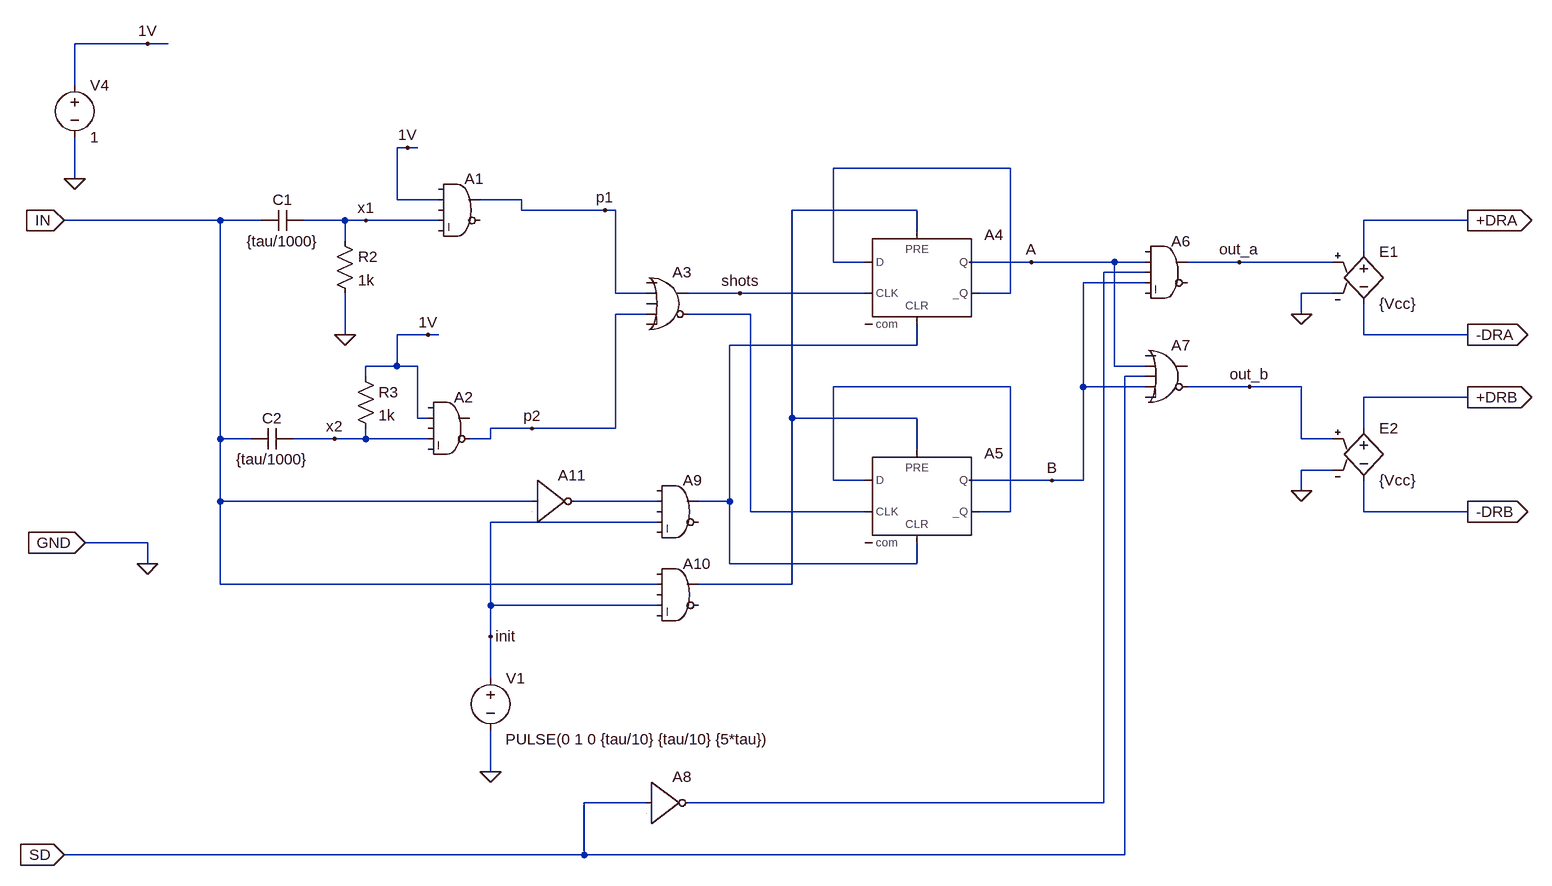
[diagram p0: schematic DriverHB_dead_time_component.asc]
DriverHB_dead_time_component.asc, the LTspice schematic file:
Version 4
SHEET 1 1872 1944
WIRE -416 464 -528 464
WIRE -384 464 -416 464
WIRE -528 528 -528 464
WIRE -16 624 -32 624
WIRE 0 624 -16 624
WIRE 912 656 640 656
WIRE -528 672 -528 608
WIRE -32 704 -32 624
WIRE 32 704 -32 704
WIRE 160 704 96 704
WIRE 160 720 160 704
WIRE 288 720 160 720
WIRE 304 720 288 720
WIRE 768 720 576 720
WIRE -304 736 -544 736
WIRE -240 736 -304 736
WIRE -112 736 -176 736
WIRE -80 736 -112 736
WIRE 32 736 -80 736
WIRE 1616 736 1456 736
WIRE 768 752 768 720
WIRE -112 768 -112 736
WIRE 1456 784 1456 736
WIRE 640 800 640 656
WIRE 688 800 640 800
WIRE 944 800 848 800
WIRE 1072 800 944 800
WIRE 1120 800 1072 800
WIRE 1264 800 1184 800
WIRE 1408 800 1264 800
WIRE 1120 816 1056 816
WIRE 1120 832 1024 832
WIRE 304 848 304 720
WIRE 352 848 304 848
WIRE 496 848 416 848
WIRE 688 848 496 848
WIRE 912 848 912 656
WIRE 912 848 864 848
WIRE 1408 848 1360 848
WIRE 352 880 304 880
WIRE 512 880 416 880
WIRE 1360 880 1360 848
WIRE -112 912 -112 848
WIRE 16 912 -32 912
WIRE 32 912 16 912
WIRE 1456 912 1456 864
WIRE 1616 912 1456 912
WIRE 768 928 768 896
WIRE 768 928 480 928
WIRE -32 960 -32 912
WIRE -32 960 -80 960
WIRE 0 960 -32 960
WIRE 1072 960 1072 800
WIRE 1120 960 1072 960
WIRE -80 976 -80 960
WIRE 1120 976 1088 976
WIRE 912 992 640 992
WIRE 1024 992 1024 832
WIRE 1120 992 1024 992
WIRE 1280 992 1184 992
WIRE 1360 992 1280 992
WIRE 1616 1008 1456 1008
WIRE 0 1040 0 960
WIRE 16 1040 0 1040
WIRE 576 1040 576 720
WIRE 768 1040 576 1040
WIRE 176 1056 112 1056
WIRE 304 1056 304 880
WIRE 304 1056 176 1056
WIRE 1456 1056 1456 1008
WIRE -304 1072 -304 736
WIRE -256 1072 -304 1072
WIRE -128 1072 -192 1072
WIRE -80 1072 -80 1056
WIRE -80 1072 -128 1072
WIRE 16 1072 -80 1072
WIRE 112 1072 112 1056
WIRE 112 1072 80 1072
WIRE 1360 1072 1360 992
WIRE 1408 1072 1360 1072
WIRE 768 1088 768 1040
WIRE 1408 1120 1360 1120
WIRE 640 1136 640 992
WIRE 688 1136 640 1136
WIRE 976 1136 848 1136
WIRE 1024 1136 1024 992
WIRE 1024 1136 976 1136
WIRE 1360 1152 1360 1120
WIRE -304 1168 -304 1072
WIRE 176 1168 -304 1168
WIRE 368 1168 240 1168
WIRE 480 1168 480 928
WIRE 480 1168 432 1168
WIRE 512 1184 512 880
WIRE 688 1184 512 1184
WIRE 912 1184 912 992
WIRE 912 1184 864 1184
WIRE 1456 1184 1456 1136
WIRE 1616 1184 1456 1184
WIRE 368 1200 112 1200
WIRE -416 1232 -512 1232
WIRE -416 1264 -416 1232
WIRE 480 1264 480 1168
WIRE 768 1264 768 1232
WIRE 768 1264 480 1264
WIRE -304 1296 -304 1168
WIRE 368 1296 -304 1296
WIRE 576 1296 576 1040
WIRE 576 1296 432 1296
WIRE 112 1328 112 1200
WIRE 368 1328 112 1328
WIRE 112 1376 112 1328
WIRE 112 1440 112 1376
WIRE 112 1584 112 1520
WIRE 352 1632 256 1632
WIRE 1056 1632 1056 816
WIRE 1056 1632 416 1632
WIRE 256 1712 256 1632
WIRE 256 1712 -544 1712
WIRE 1088 1712 1088 976
WIRE 1088 1712 256 1712
FLAG -16 624 1V
FLAG -112 912 0
FLAG 288 720 p1
FLAG 176 1056 p2
FLAG 16 912 1V
FLAG -80 736 x1
FLAG -128 1072 x2
FLAG -528 672 0
FLAG -416 464 1V
FLAG 496 848 shots
FLAG 944 800 A
FLAG 976 1136 B
FLAG 1264 800 out_a
FLAG 1280 992 out_b
FLAG 1360 880 0
FLAG 1616 736 +DRA
IOPIN 1616 736 Out
FLAG 1616 912 -DRA
IOPIN 1616 912 Out
FLAG 1360 1152 0
FLAG 1616 1008 +DRB
IOPIN 1616 1008 Out
FLAG 1616 1184 -DRB
IOPIN 1616 1184 Out
FLAG -544 736 IN
IOPIN -544 736 In
FLAG -544 1712 SD
IOPIN -544 1712 In
FLAG 112 1584 0
FLAG -416 1264 0
FLAG -512 1232 GND
IOPIN -512 1232 In
FLAG 112 1376 init
SYMBOL cap -176 720 R90
WINDOW 0 0 32 VBottom 2
WINDOW 3 32 32 VTop 2
SYMATTR InstName C1
SYMATTR Value {tau/1000}
SYMBOL res -128 752 R0
SYMATTR InstName R2
SYMATTR Value 1k
SYMBOL res -96 960 R0
SYMATTR InstName R3
SYMATTR Value 1k
SYMBOL cap -192 1056 R90
WINDOW 0 0 32 VBottom 2
WINDOW 3 32 32 VTop 2
SYMATTR InstName C2
SYMATTR Value {tau/1000}
SYMBOL Digital\\and 64 656 R0
SYMATTR InstName A1
SYMBOL Digital\\and 48 992 R0
SYMATTR InstName A2
SYMBOL voltage -528 512 R0
WINDOW 123 0 0 Left 0
WINDOW 39 0 0 Left 0
SYMATTR InstName V4
SYMATTR Value 1
SYMBOL Digital\\or 384 800 R0
SYMATTR InstName A3
SYMBOL Digital\\dflop 768 752 R0
SYMATTR InstName A4
SYMBOL Digital\\dflop 768 1088 R0
SYMATTR InstName A5
SYMBOL Digital\\and 1152 752 R0
SYMATTR InstName A6
SYMBOL Digital\\or 1152 912 R0
SYMATTR InstName A7
SYMBOL e 1456 768 R0
SYMATTR InstName E1
SYMATTR Value {Vcc}
SYMBOL e 1456 1040 R0
SYMATTR InstName E2
SYMATTR Value {Vcc}
SYMBOL Digital\\inv 352 1568 R0
SYMATTR InstName A8
SYMBOL voltage 112 1424 R0
WINDOW 3 23 110 Left 2
WINDOW 123 0 0 Left 0
WINDOW 39 0 0 Left 0
SYMATTR Value PULSE(0 1 0 {tau/10} {tau/10} {5*tau})
SYMATTR InstName V1
SYMBOL Digital\\and 400 1120 R0
SYMATTR InstName A9
SYMBOL Digital\\and 400 1248 R0
SYMATTR InstName A10
SYMBOL Digital\\inv 176 1104 R0
SYMATTR InstName A11

The netlist it stands for:
* DriverHB_dead_time_component.asc
C1 x1 IN {tau/1000}
R2 x1 0 1k
R3 1V x2 1k
C2 x2 IN {tau/1000}
A1 0 1V 0 x1 0 0 p1 0 AND
A2 0 1V 0 x2 0 p2 0 0 AND
V4 1V 0 1
A3 0 p1 0 p2 0 N004 shots 0 OR
A4 N001 0 shots N002 N005 N001 A 0 DFLOP
A5 N006 0 N004 N002 N005 N006 B 0 DFLOP
A6 0 A N003 B 0 0 out_a 0 AND
A7 0 A SD B 0 out_b 0 0 OR
E1 +DRA -DRA out_a 0 {Vcc}
E2 +DRB -DRB out_b 0 {Vcc}
A8 SD 0 0 0 0 N003 0 0 BUF
V1 init 0 PULSE(0 1 0 {tau/10} {tau/10} {5*tau})
A9 0 N007 0 init 0 0 N005 0 AND
A10 0 IN 0 init 0 0 N002 0 AND
A11 IN 0 0 0 0 N007 0 0 BUF
.backanno
.end